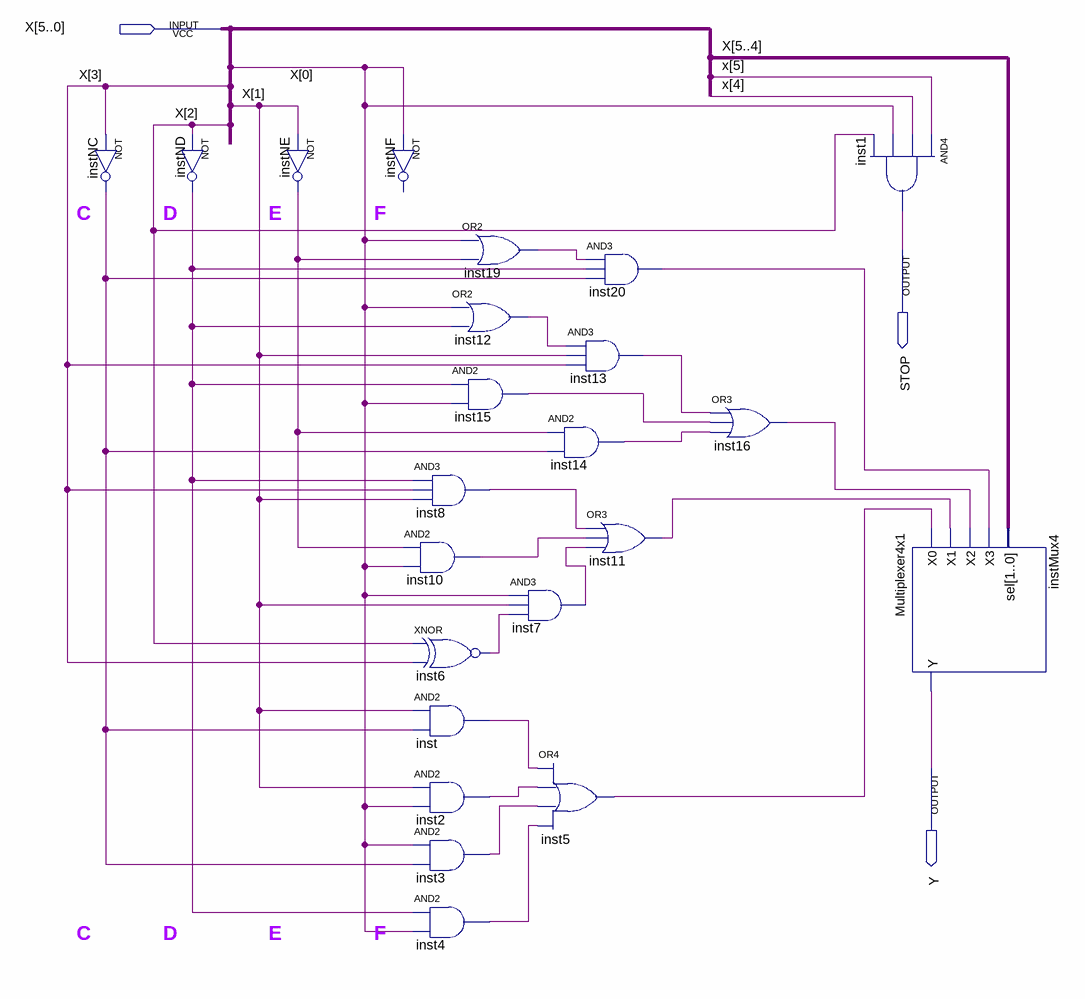
[diagram p0: schematic sheet]
// Quartus schematic MorseBDF_prototype.bdf as structural Verilog: 23 symbols, 3 pins
module MorseBDF_prototype (
  input  [5:0] X,
  output STOP,
  output Y
);

  wire inst2_out, inst3_out, inst4_out, inst5_out, inst6_out, inst7_out, inst8_out, inst10_out, inst11_out,
       inst12_out, inst13_out, inst14_out, inst15_out, inst16_out, inst19_out, inst20_out, inst_out,
       instNC_out, instND_out, instNE_out;

  not instNC (instNC_out, X[3]);
  not instND (instND_out, X[2]);
  not instNE (instNE_out, X[1]);
  // NOT instNF has open pins: IN=X[0], OUT=open
  or inst12 (inst12_out, X[0], instND_out);
  and inst15 (inst15_out, instND_out, X[0]);
  and inst8 (inst8_out, instND_out, X[3], X[1]);
  and inst10 (inst10_out, instNE_out, X[0]);
  xnor inst6 (inst6_out, X[2], X[3]);
  and inst (inst_out, X[1], instNC_out);
  and inst2 (inst2_out, X[1], X[0]);
  and inst3 (inst3_out, X[0], instNC_out);
  and inst4 (inst4_out, instND_out, X[0]);
  or inst19 (inst19_out, X[0], instNE_out);
  and inst7 (inst7_out, X[0], X[1], inst6_out);
  and inst20 (inst20_out, inst19_out, instND_out, instNC_out);
  and inst13 (inst13_out, inst12_out, X[1], X[3]);
  and inst14 (inst14_out, instNE_out, instNC_out);
  or inst11 (inst11_out, inst8_out, inst10_out, inst7_out);
  or inst5 (inst5_out, inst_out, inst2_out, inst3_out, inst4_out);
  or inst16 (inst16_out, inst13_out, inst15_out, inst14_out);
  and inst1 (STOP, X[5], X[4], X[0], X[2]);
  Multiplexer4x1 instMux4 (.X0(inst5_out), .X1(inst11_out), .X2(inst16_out), .X3(inst20_out), .sel(X[5:4]), .Y(Y));

  // Notes on the sheet:
  //   C
  //   D
  //   E
  //   F
  //   C
  //   D
  //   E
  //   F
endmodule
